# EAGLE schematic sboardnew (EAGLE 6.6.0)

## Sheet 1 of 5
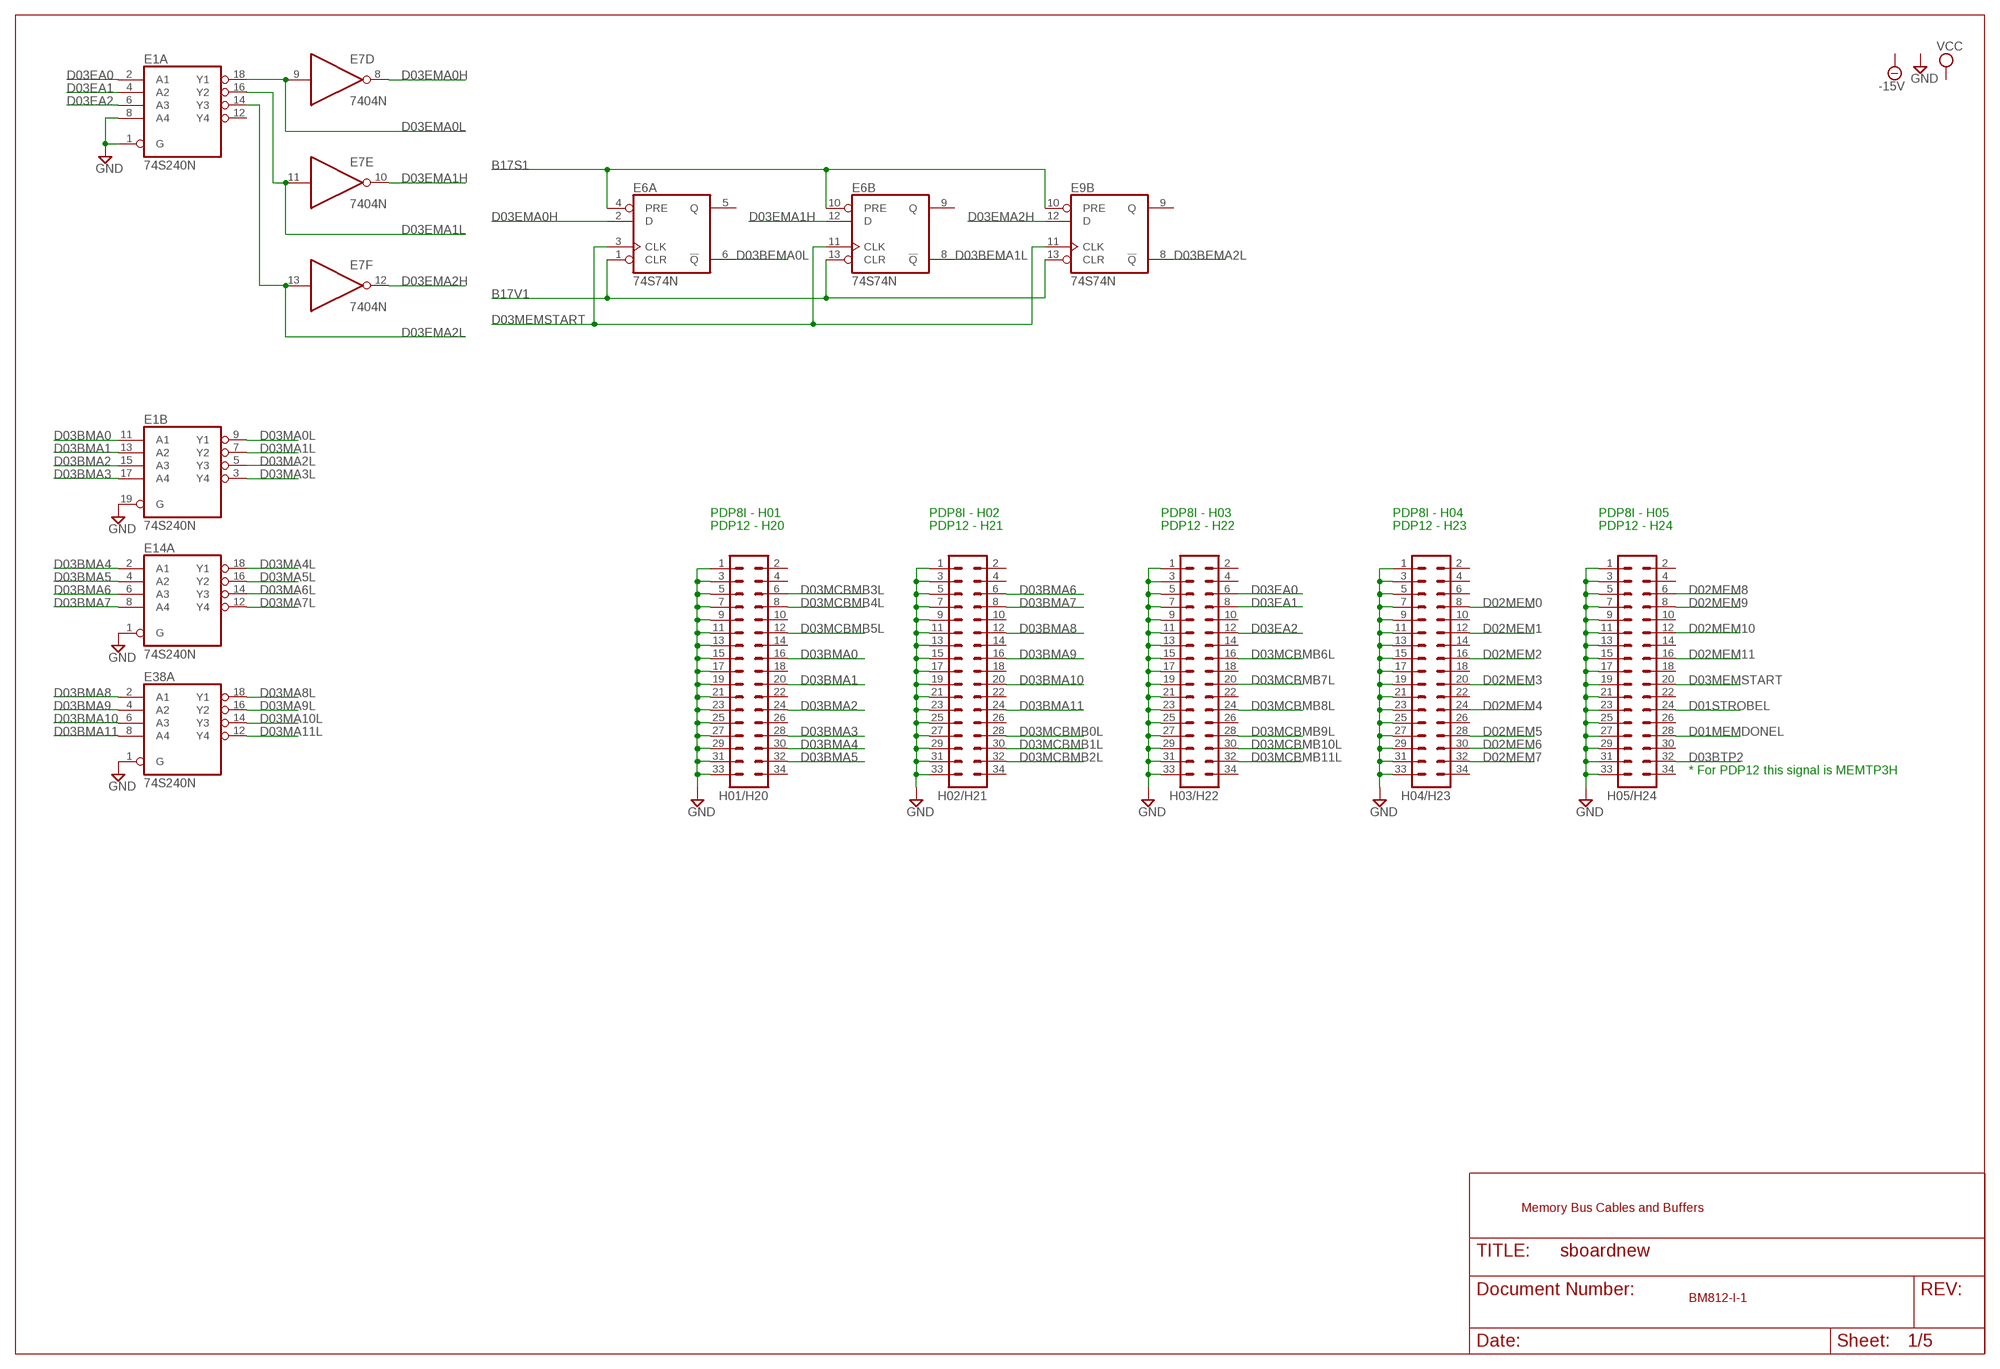
[diagram p0: schematic, sheet 1]

### Parts
E1  74S240N  [DIL20]
E6  74S74N  [DIL14]
E7  7404N  [DIL14]
E9  74S74N  [DIL14]
E14  74S240N  [DIL20]
E38  74S240N  [DIL20]
H01/H20  MA17-2  [MA17-2]
H02/H21  MA17-2  [MA17-2]
H03/H22  MA17-2  [MA17-2]
H04/H23  MA17-2  [MA17-2]
H05/H24  MA17-2  [MA17-2]

### Nets
B17S1: E6.4(A:PRE) E6.10(B:PRE) E9.10(B:PRE) ; also sheet 3,4
B17V1: E6.1(A:CLR) E6.13(B:CLR) E9.13(B:CLR) ; also sheet 3,4
D01MEMDONEL: H05/H24.28 ; also sheet 4
D01STROBEL: H05/H24.24 ; also sheet 4
D02MEM0: H04/H23.8 ; also sheet 3
D02MEM1: H04/H23.12 ; also sheet 3
D02MEM2: H04/H23.16 ; also sheet 3
D02MEM3: H04/H23.20 ; also sheet 3
D02MEM4: H04/H23.24 ; also sheet 3
D02MEM5: H04/H23.28 ; also sheet 3
D02MEM6: H04/H23.30 ; also sheet 3
D02MEM7: H04/H23.32 ; also sheet 3
D02MEM8: H05/H24.6 ; also sheet 3
D02MEM9: H05/H24.8 ; also sheet 3
D02MEM10: H05/H24.12 ; also sheet 3
D02MEM11: H05/H24.16 ; also sheet 3
D03BEMA0L: E6.6(A:!Q) ; also sheet 5
D03BEMA1L: E6.8(B:!Q) ; also sheet 5
D03BEMA2L: E9.8(B:!Q) ; also sheet 5
D03BMA0: E1.11(B:A1) H01/H20.16
D03BMA1: E1.13(B:A2) H01/H20.20
D03BMA2: E1.15(B:A3) H01/H20.24
D03BMA3: E1.17(B:A4) H01/H20.28
D03BMA4: E14.2(A:A1) H01/H20.30
D03BMA5: E14.4(A:A2) H01/H20.32
D03BMA6: E14.6(A:A3) H02/H21.6
D03BMA7: E14.8(A:A4) H02/H21.8
D03BMA8: E38.2(A:A1) H02/H21.12
D03BMA9: E38.4(A:A2) H02/H21.16
D03BMA10: E38.6(A:A3) H02/H21.20
D03BMA11: E38.8(A:A4) H02/H21.24
D03BTP2: H05/H24.32 ; also sheet 4
D03EA0: E1.2(A:A1) H03/H22.6
D03EA1: E1.4(A:A2) H03/H22.8
D03EA2: E1.6(A:A3) H03/H22.12
D03EMA0H: E6.2(A:D) E7.8(D:O) ; also sheet 4
D03EMA0L: E1.18(A:Y1) E7.9(D:I) ; also sheet 4
D03EMA1H: E6.12(B:D) E7.10(E:O) ; also sheet 4
D03EMA1L: E1.16(A:Y2) E7.11(E:I) ; also sheet 4
D03EMA2H: E7.12(F:O) E9.12(B:D) ; also sheet 4
D03EMA2L: E1.14(A:Y3) E7.13(F:I) ; also sheet 4
D03MA0L: E1.9(B:Y1) ; also sheet 5
D03MA1L: E1.7(B:Y2) ; also sheet 5
D03MA2L: E1.5(B:Y3) ; also sheet 5
D03MA3L: E1.3(B:Y4) ; also sheet 5
D03MA4L: E14.18(A:Y1) ; also sheet 5
D03MA5L: E14.16(A:Y2) ; also sheet 5
D03MA6L: E14.14(A:Y3) ; also sheet 5
D03MA7L: E14.12(A:Y4) ; also sheet 5
D03MA8L: E38.18(A:Y1) ; also sheet 5
D03MA9L: E38.16(A:Y2) ; also sheet 5
D03MA10L: E38.14(A:Y3) ; also sheet 5
D03MA11L: E38.12(A:Y4) ; also sheet 5
D03MCBMB0L: H02/H21.28 ; also sheet 2
D03MCBMB1L: H02/H21.30 ; also sheet 2
D03MCBMB2L: H02/H21.32 ; also sheet 2
D03MCBMB3L: H01/H20.6 ; also sheet 2
D03MCBMB4L: H01/H20.8 ; also sheet 2
D03MCBMB5L: H01/H20.12 ; also sheet 2
D03MCBMB6L: H03/H22.16 ; also sheet 2
D03MCBMB7L: H03/H22.20 ; also sheet 2
D03MCBMB8L: H03/H22.24 ; also sheet 2
D03MCBMB9L: H03/H22.28 ; also sheet 2
D03MCBMB10L: H03/H22.30 ; also sheet 2
D03MCBMB11L: H03/H22.32 ; also sheet 2
D03MEMSTART: E6.3(A:CLK) E6.11(B:CLK) E9.11(B:CLK) H05/H24.20 ; also sheet 4
GND [Power]: E1.1(A:G) E1.8(A:A4) E1.19(B:G) E14.1(A:G) E38.1(A:G) H01/H20.1 H01/H20.3 H01/H20.5 H01/H20.7 H01/H20.9 H01/H20.11 H01/H20.13 H01/H20.15 H01/H20.17 H01/H20.19 H01/H20.21 H01/H20.23 H01/H20.25 H01/H20.27 H01/H20.29 H01/H20.31 H01/H20.33 H02/H21.1 H02/H21.3 H02/H21.5 H02/H21.7 H02/H21.9 H02/H21.11 H02/H21.13 H02/H21.15 H02/H21.17 H02/H21.19 H02/H21.21 H02/H21.23 H02/H21.25 H02/H21.27 H02/H21.29 H02/H21.31 H02/H21.33 H03/H22.1 H03/H22.3 H03/H22.5 H03/H22.7 H03/H22.9 H03/H22.11 H03/H22.13 H03/H22.15 H03/H22.17 H03/H22.19 H03/H22.21 H03/H22.23 H03/H22.25 H03/H22.27 H03/H22.29 H03/H22.31 H03/H22.33 H04/H23.1 H04/H23.3 H04/H23.5 H04/H23.7 H04/H23.9 H04/H23.11 H04/H23.13 H04/H23.15 H04/H23.17 H04/H23.19 H04/H23.21 H04/H23.23 H04/H23.25 H04/H23.27 H04/H23.29 H04/H23.31 H04/H23.33 H05/H24.1 H05/H24.3 H05/H24.5 H05/H24.7 H05/H24.9 H05/H24.11 H05/H24.13 H05/H24.15 H05/H24.17 H05/H24.19 H05/H24.21 H05/H24.23 H05/H24.25 H05/H24.27 H05/H24.29 H05/H24.31 H05/H24.33 ; also sheet 3,4,5
Unconnected: E1.12(A:Y4) E6.5(A:Q) E6.9(B:Q) E9.9(B:Q) E38.3(B:Y4) E38.5(B:Y3) E38.7(B:Y2) E38.9(B:Y1) E38.11(B:A1) E38.13(B:A2) E38.15(B:A3) E38.17(B:A4) E38.19(B:G) H01/H20.2 H01/H20.4 H01/H20.10 H01/H20.14 H01/H20.18 H01/H20.22 H01/H20.26 H01/H20.34 H02/H21.2 H02/H21.4 H02/H21.10 H02/H21.14 H02/H21.18 H02/H21.22 H02/H21.26 H02/H21.34 H03/H22.2 H03/H22.4 H03/H22.10 H03/H22.14 H03/H22.18 H03/H22.22 H03/H22.26 H03/H22.34 H04/H23.2 H04/H23.4 H04/H23.6 H04/H23.10 H04/H23.14 H04/H23.18 H04/H23.22 H04/H23.26 H04/H23.34 H05/H24.2 H05/H24.4 H05/H24.10 H05/H24.14 H05/H24.18 H05/H24.22 H05/H24.26 H05/H24.30 H05/H24.34

### Notes on the sheet
- PDP8I - H01 | PDP8I - H02 | PDP8I - H03 | PDP8I - H04 | PDP8I - H05
- PDP12 - H20 | PDP12 - H21 | PDP12 - H22 | PDP12 - H23 | PDP12 - H24
- * For PDP12 this signal is MEMTP3H
- Memory Bus Cables and Buffers
- BM812-I-1

## Sheet 2 of 5
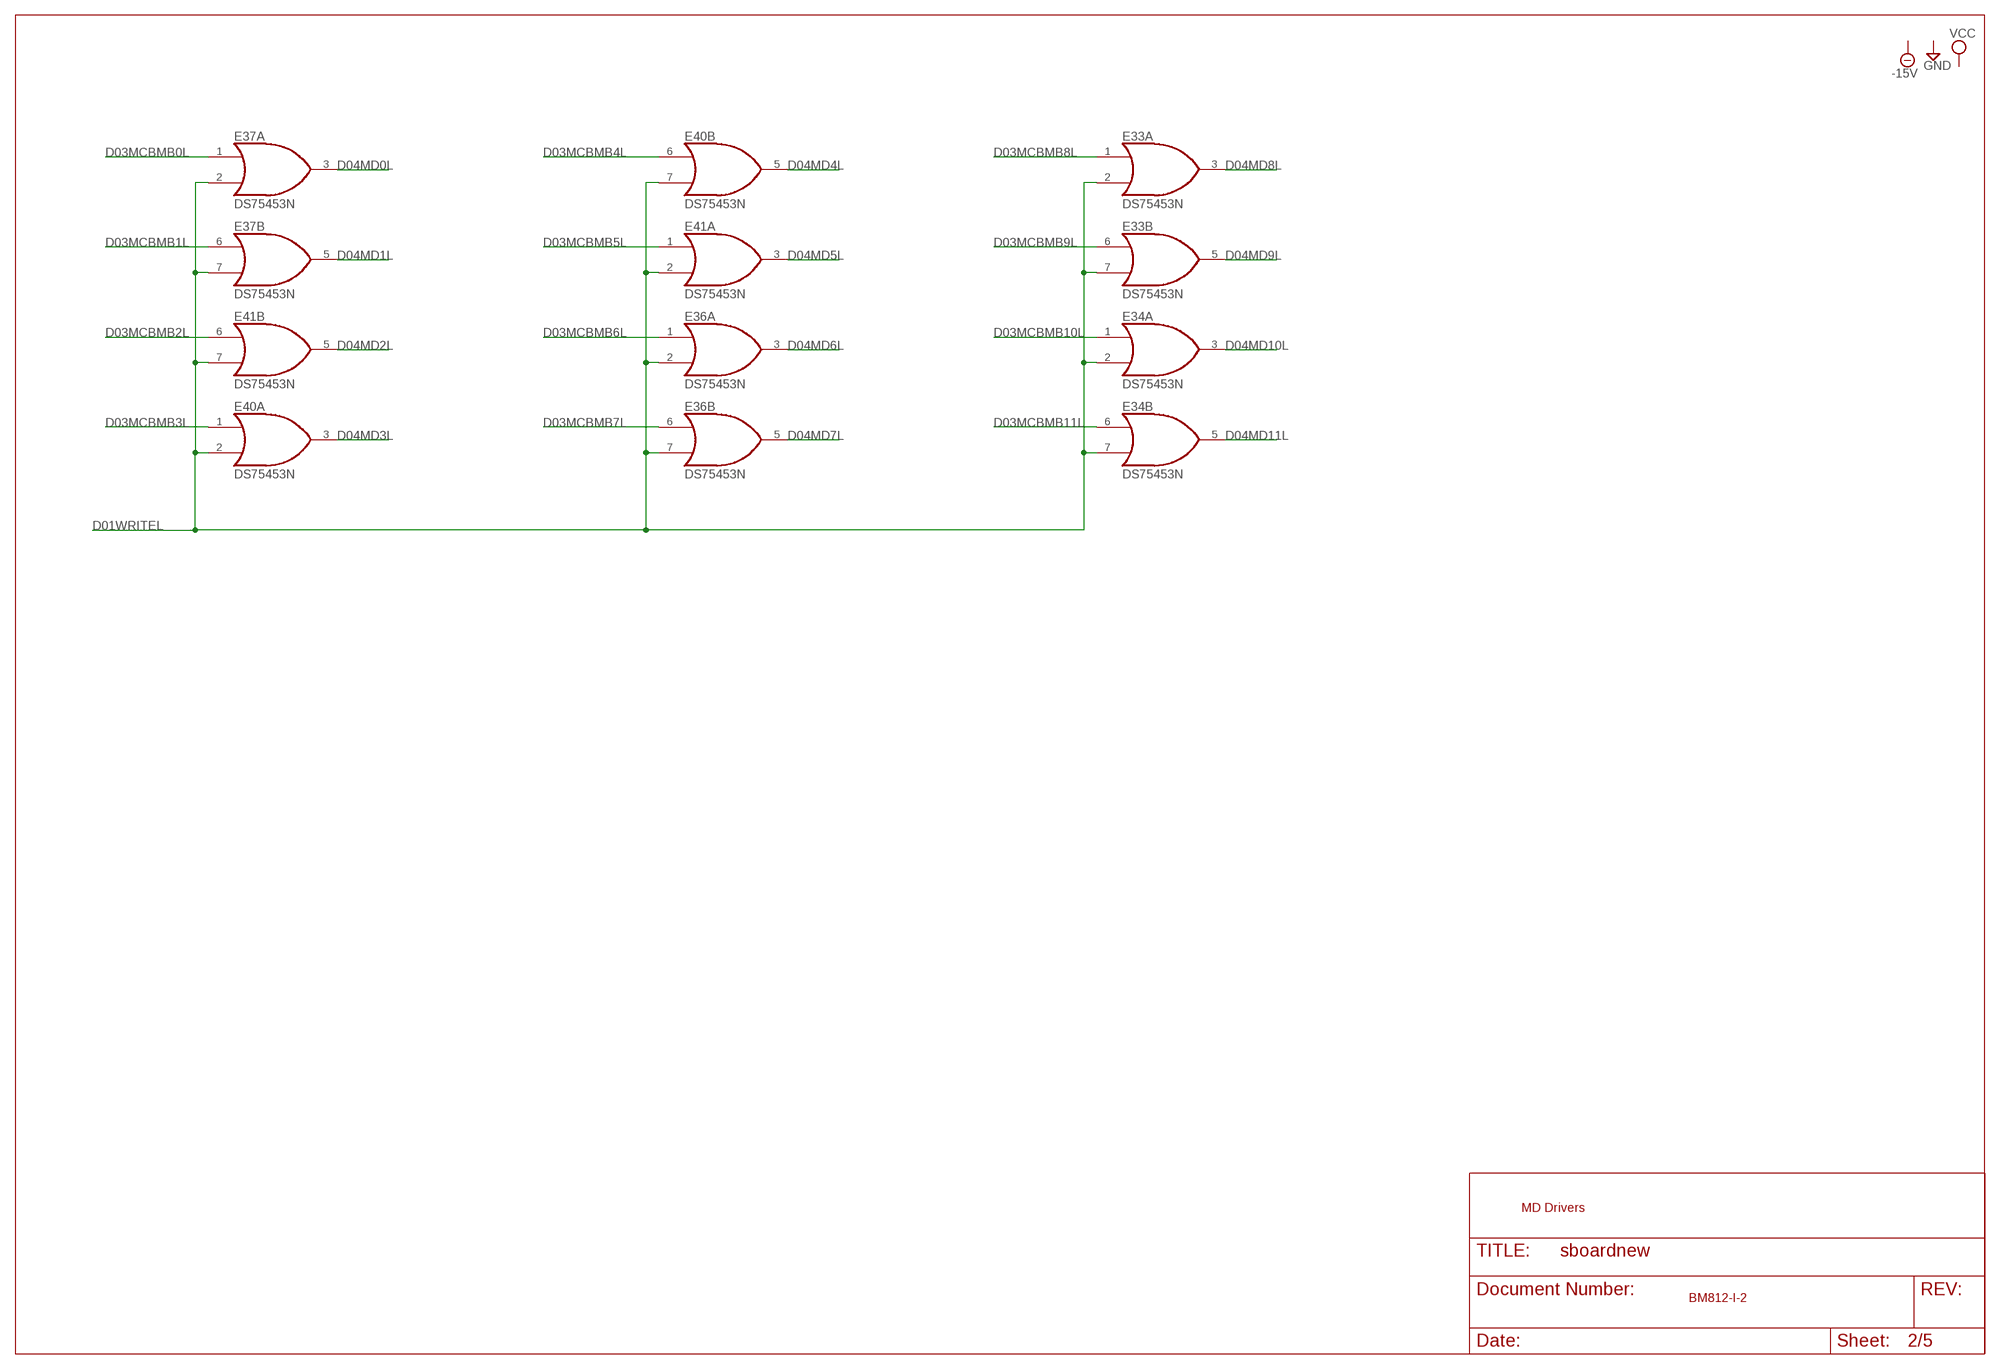
[diagram p1: schematic, sheet 2]

### Parts
E33  DS75453N  [DIL08]
E34  DS75453N  [DIL08]
E36  DS75453N  [DIL08]
E37  DS75453N  [DIL08]
E40  DS75453N  [DIL08]
E41  DS75453N  [DIL08]

### Nets
D01WRITEL: E33.2(A:I1) E33.7(B:I1) E34.2(A:I1) E34.7(B:I1) E36.2(A:I1) E36.7(B:I1) E37.2(A:I1) E37.7(B:I1) E40.2(A:I1) E40.7(B:I1) E41.2(A:I1) E41.7(B:I1) ; also sheet 3
D03MCBMB0L: E37.1(A:I0) ; also sheet 1
D03MCBMB1L: E37.6(B:I0) ; also sheet 1
D03MCBMB2L: E41.6(B:I0) ; also sheet 1
D03MCBMB3L: E40.1(A:I0) ; also sheet 1
D03MCBMB4L: E40.6(B:I0) ; also sheet 1
D03MCBMB5L: E41.1(A:I0) ; also sheet 1
D03MCBMB6L: E36.1(A:I0) ; also sheet 1
D03MCBMB7L: E36.6(B:I0) ; also sheet 1
D03MCBMB8L: E33.1(A:I0) ; also sheet 1
D03MCBMB9L: E33.6(B:I0) ; also sheet 1
D03MCBMB10L: E34.1(A:I0) ; also sheet 1
D03MCBMB11L: E34.6(B:I0) ; also sheet 1
D04MD0L: E37.3(A:O) ; also sheet 3,5
D04MD1L: E37.5(B:O) ; also sheet 3,5
D04MD2L: E41.5(B:O) ; also sheet 3,5
D04MD3L: E40.3(A:O) ; also sheet 3,5
D04MD4L: E40.5(B:O) ; also sheet 3,5
D04MD5L: E41.3(A:O) ; also sheet 3,5
D04MD6L: E36.3(A:O) ; also sheet 3,5
D04MD7L: E36.5(B:O) ; also sheet 3,5
D04MD8L: E33.3(A:O) ; also sheet 3,5
D04MD9L: E33.5(B:O) ; also sheet 3,5
D04MD10L: E34.3(A:O) ; also sheet 3,5
D04MD11L: E34.5(B:O) ; also sheet 3,5

### Notes on the sheet
- MD Drivers
- BM812-I-2

## Sheet 3 of 5
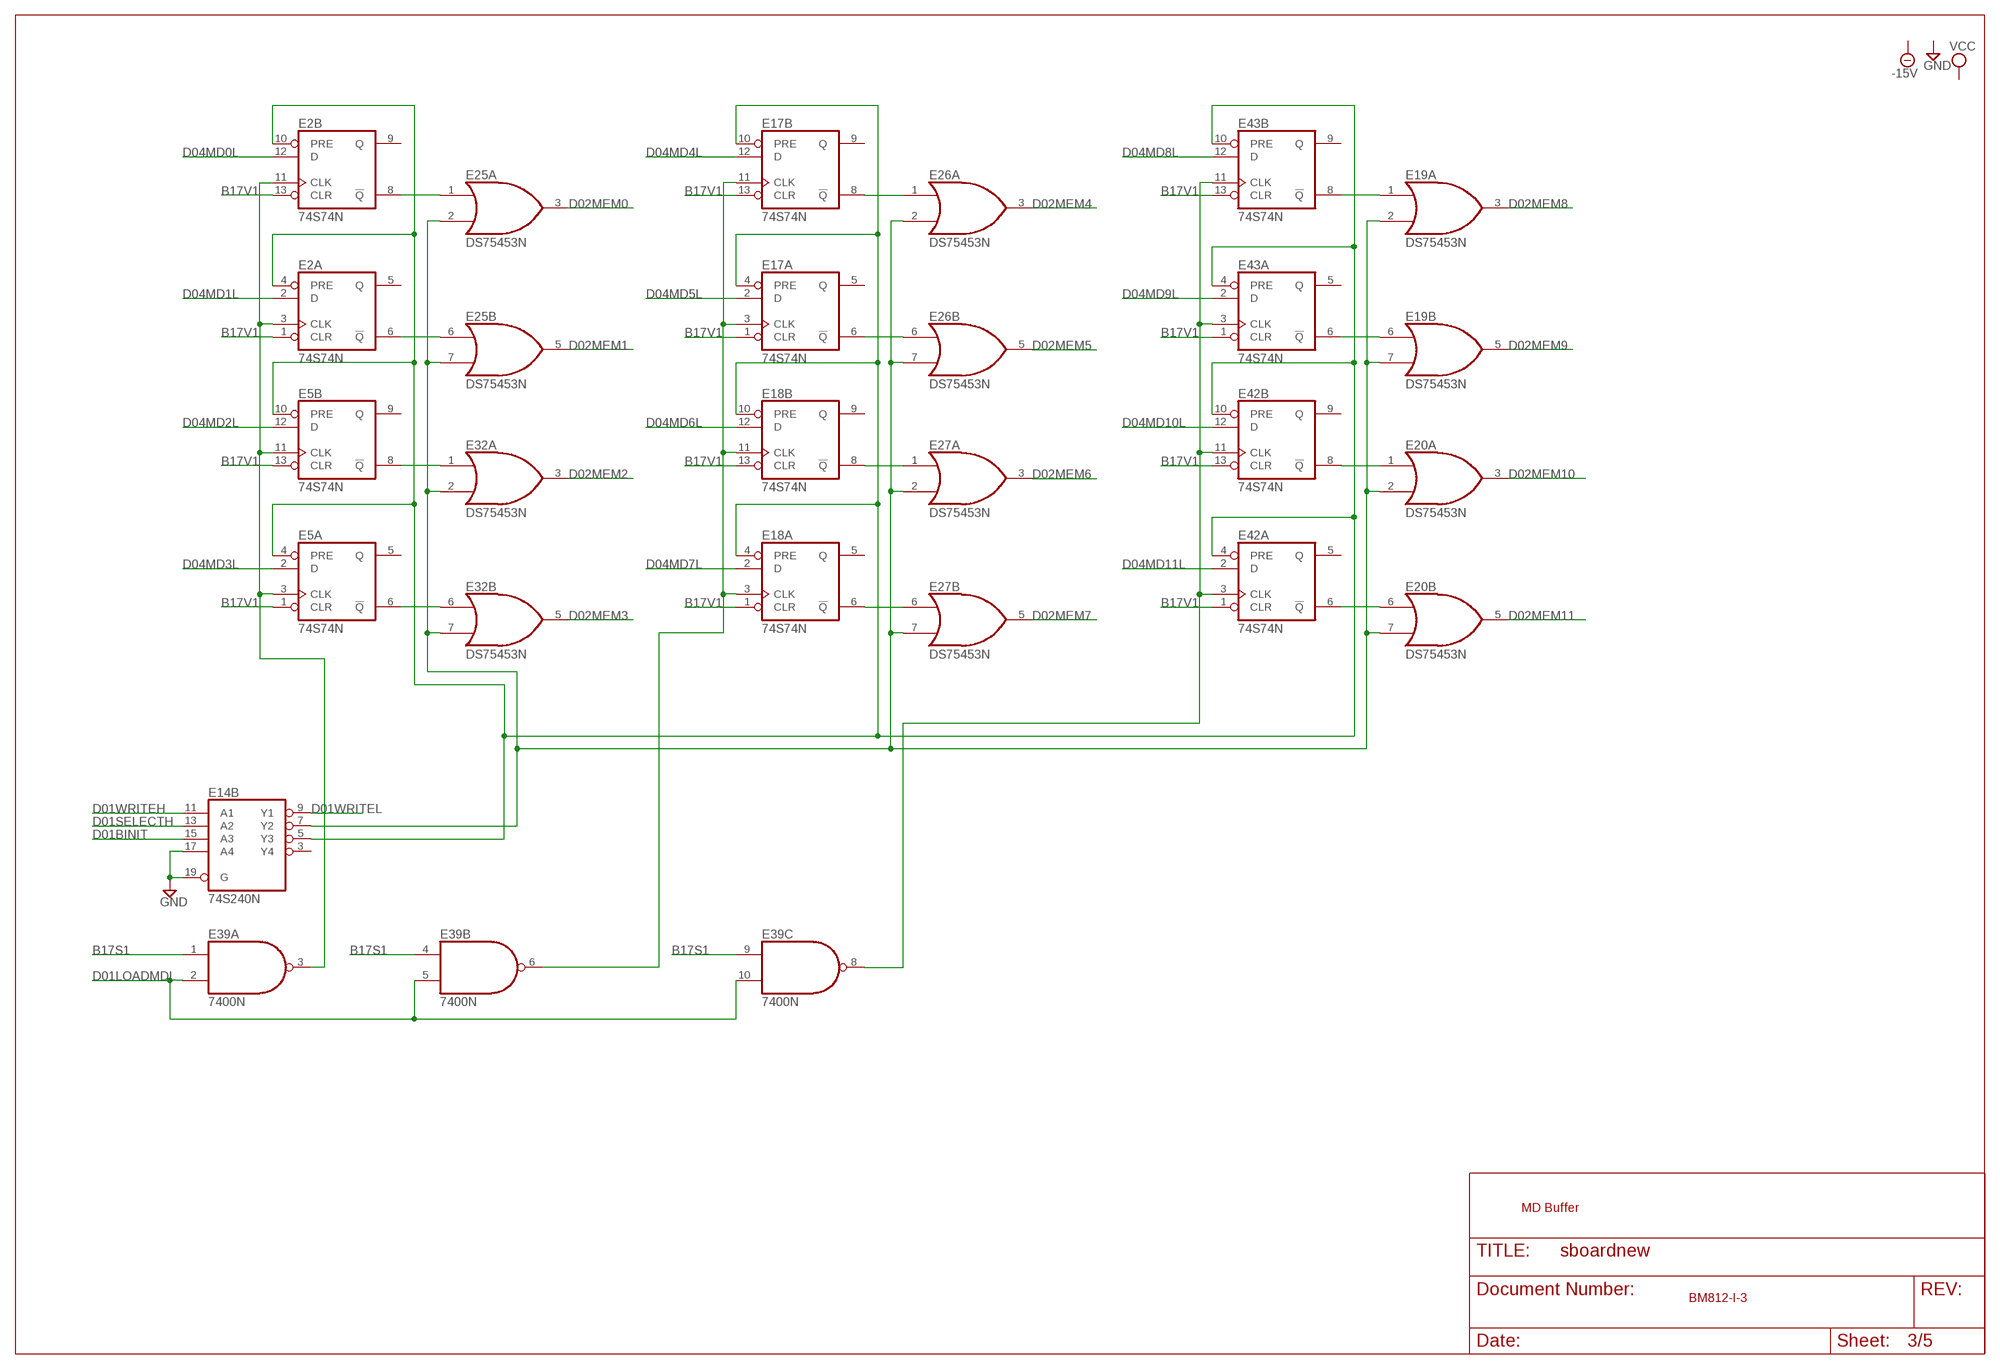
[diagram p2: schematic, sheet 3]

### Parts
E2  74S74N  [DIL14]
E5  74S74N  [DIL14]
E17  74S74N  [DIL14]
E18  74S74N  [DIL14]
E19  DS75453N  [DIL08]
E20  DS75453N  [DIL08]
E25  DS75453N  [DIL08]
E26  DS75453N  [DIL08]
E27  DS75453N  [DIL08]
E32  DS75453N  [DIL08]
E39  7400N  [DIL14]
E42  74S74N  [DIL14]
E43  74S74N  [DIL14]

### Nets
B17S1: E39.1(A:I0) E39.4(B:I0) E39.9(C:I0) ; also sheet 1,4
B17V1: E2.1(A:CLR) E2.13(B:CLR) E5.1(A:CLR) E5.13(B:CLR) E17.1(A:CLR) E17.13(B:CLR) E18.1(A:CLR) E18.13(B:CLR) E42.1(A:CLR) E42.13(B:CLR) E43.1(A:CLR) E43.13(B:CLR) ; also sheet 1,4
D01BINIT: E14.15(B:A3) ; also sheet 4
D01LOADMDL: E39.2(A:I1) E39.5(B:I1) E39.10(C:I1) ; also sheet 4
D01SELECTH: E14.13(B:A2) ; also sheet 4
D01WRITEH: E14.11(B:A1) ; also sheet 4
D01WRITEL: E14.9(B:Y1) ; also sheet 2
D02MEM0: E25.3(A:O) ; also sheet 1
D02MEM1: E25.5(B:O) ; also sheet 1
D02MEM2: E32.3(A:O) ; also sheet 1
D02MEM3: E32.5(B:O) ; also sheet 1
D02MEM4: E26.3(A:O) ; also sheet 1
D02MEM5: E26.5(B:O) ; also sheet 1
D02MEM6: E27.3(A:O) ; also sheet 1
D02MEM7: E27.5(B:O) ; also sheet 1
D02MEM8: E19.3(A:O) ; also sheet 1
D02MEM9: E19.5(B:O) ; also sheet 1
D02MEM10: E20.3(A:O) ; also sheet 1
D02MEM11: E20.5(B:O) ; also sheet 1
D04MD0L: E2.12(B:D) ; also sheet 2,5
D04MD1L: E2.2(A:D) ; also sheet 2,5
D04MD2L: E5.12(B:D) ; also sheet 2,5
D04MD3L: E5.2(A:D) ; also sheet 2,5
D04MD4L: E17.12(B:D) ; also sheet 2,5
D04MD5L: E17.2(A:D) ; also sheet 2,5
D04MD6L: E18.12(B:D) ; also sheet 2,5
D04MD7L: E18.2(A:D) ; also sheet 2,5
D04MD8L: E43.12(B:D) ; also sheet 2,5
D04MD9L: E43.2(A:D) ; also sheet 2,5
D04MD10L: E42.12(B:D) ; also sheet 2,5
D04MD11L: E42.2(A:D) ; also sheet 2,5
GND [Power]: E14.17(B:A4) E14.19(B:G) ; also sheet 1,4,5
N$8: E2.3(A:CLK) E2.11(B:CLK) E5.3(A:CLK) E5.11(B:CLK) E39.3(A:O)
N$12: E5.6(A:!Q) E32.6(B:I0)
N$14: E2.8(B:!Q) E25.1(A:I0)
N$15: E2.6(A:!Q) E25.6(B:I0)
N$16: E17.3(A:CLK) E17.11(B:CLK) E18.3(A:CLK) E18.11(B:CLK) E39.6(B:O)
N$17: E5.8(B:!Q) E32.1(A:I0)
N$21: E2.4(A:PRE) E2.10(B:PRE) E5.4(A:PRE) E5.10(B:PRE) E14.5(B:Y3) E17.4(A:PRE) E17.10(B:PRE) E18.4(A:PRE) E18.10(B:PRE) E42.4(A:PRE) E42.10(B:PRE) E43.4(A:PRE) E43.10(B:PRE)
N$22: E14.7(B:Y2) E19.2(A:I1) E19.7(B:I1) E20.2(A:I1) E20.7(B:I1) E25.2(A:I1) E25.7(B:I1) E26.2(A:I1) E26.7(B:I1) E27.2(A:I1) E27.7(B:I1) E32.2(A:I1) E32.7(B:I1)
N$24: E17.6(A:!Q) E26.6(B:I0)
N$25: E18.6(A:!Q) E27.6(B:I0)
N$26: E18.8(B:!Q) E27.1(A:I0)
N$27: E17.8(B:!Q) E26.1(A:I0)
N$29: E20.6(B:I0) E42.6(A:!Q)
N$30: E20.1(A:I0) E42.8(B:!Q)
N$41: E39.8(C:O) E42.3(A:CLK) E42.11(B:CLK) E43.3(A:CLK) E43.11(B:CLK)
N$67: E19.6(B:I0) E43.6(A:!Q)
N$68: E19.1(A:I0) E43.8(B:!Q)
Unconnected: E2.5(A:Q) E2.9(B:Q) E5.5(A:Q) E5.9(B:Q) E14.3(B:Y4) E17.5(A:Q) E17.9(B:Q) E18.5(A:Q) E18.9(B:Q) E42.5(A:Q) E42.9(B:Q) E43.5(A:Q) E43.9(B:Q)

### Notes on the sheet
- MD Buffer
- BM812-I-3

## Sheet 4 of 5
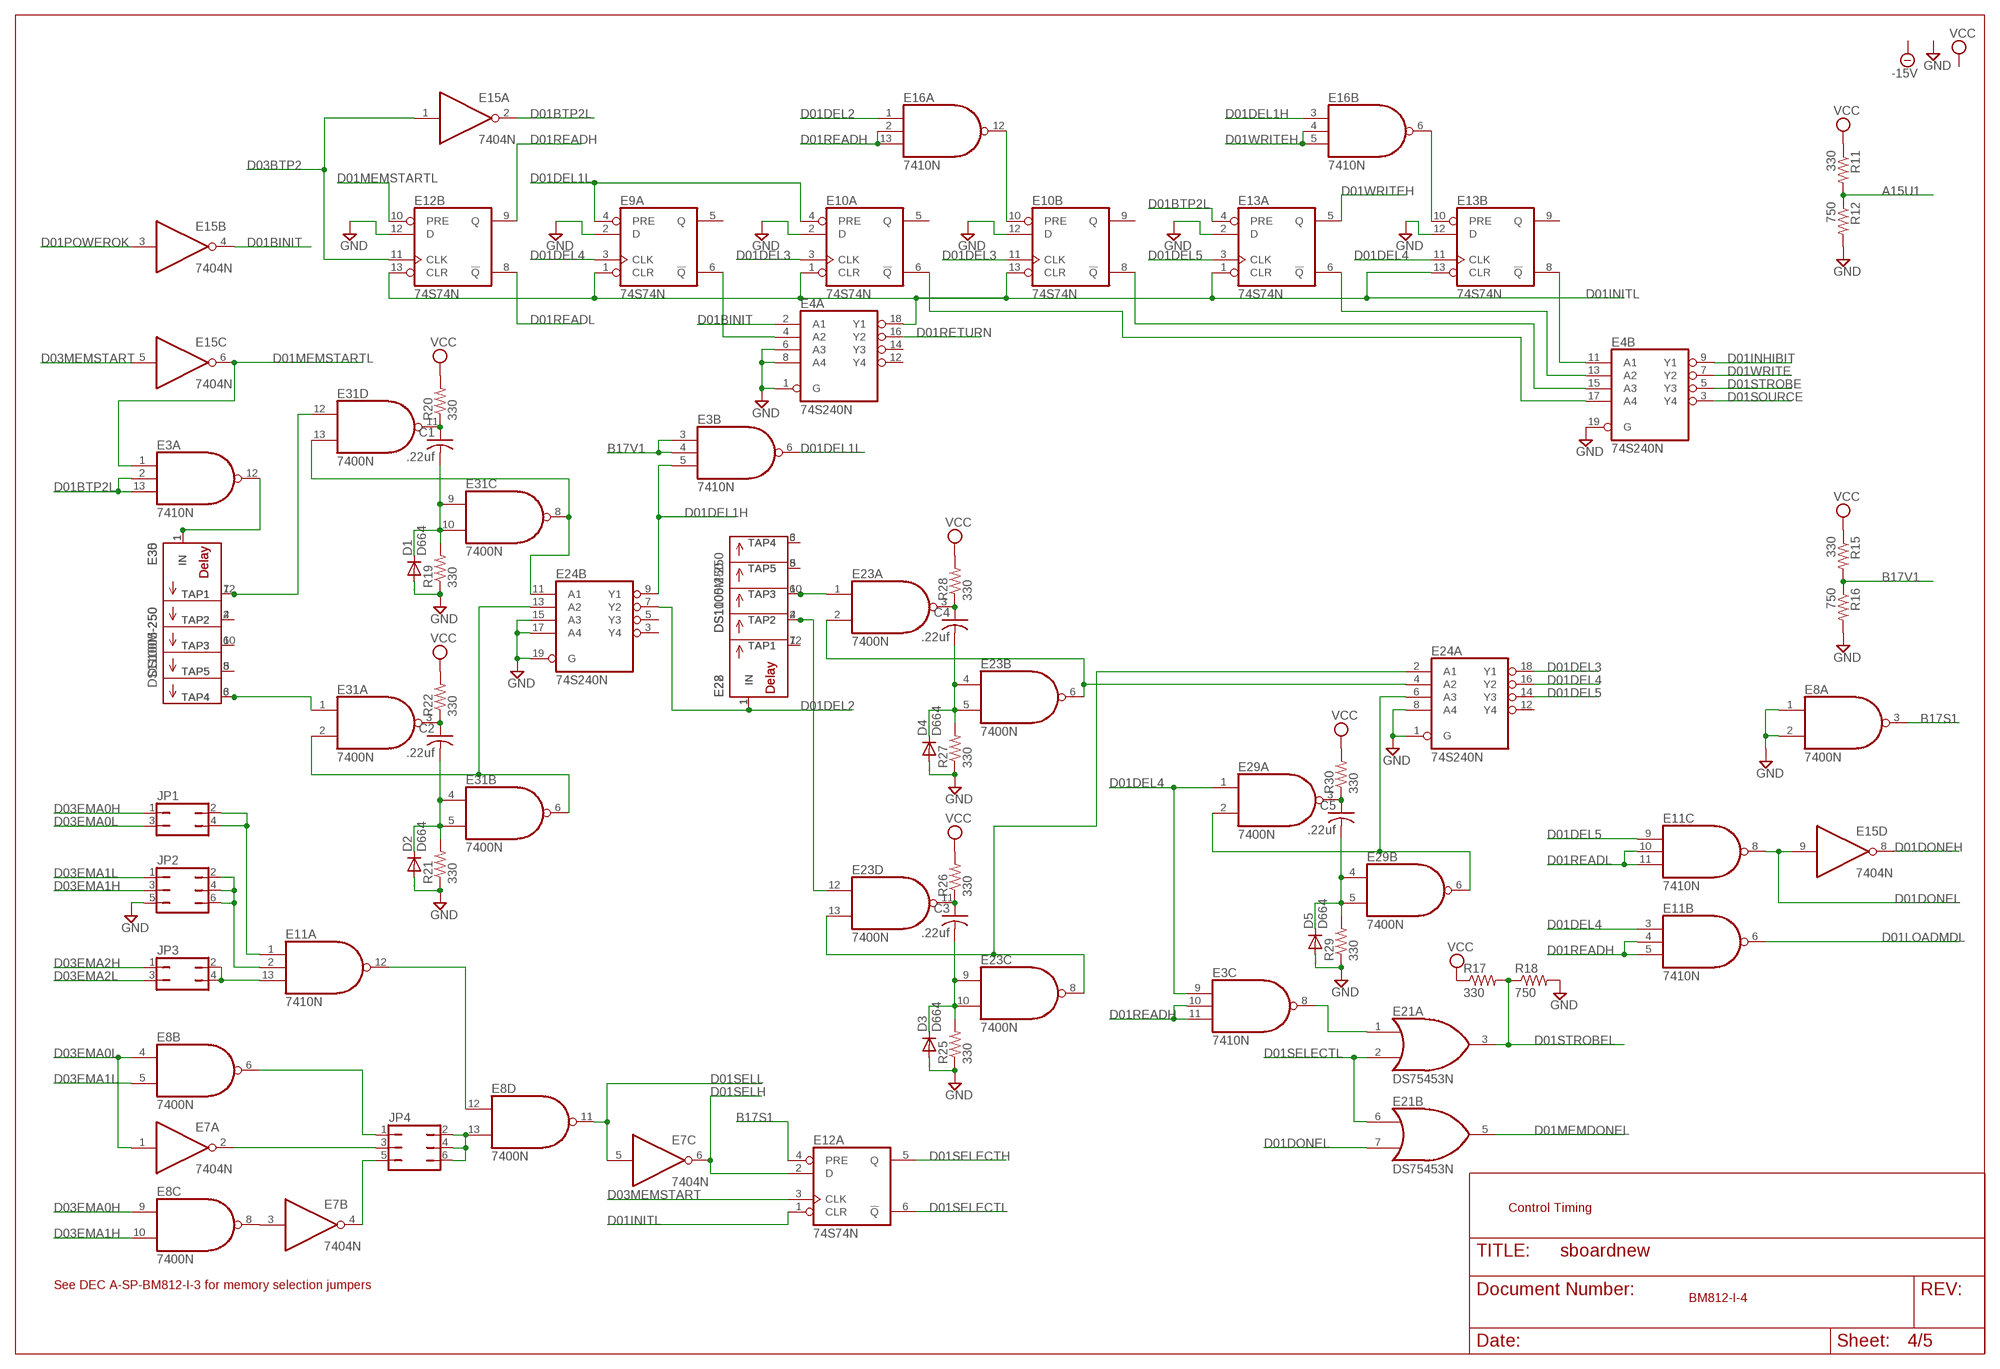
[diagram p3: schematic, sheet 4]

### Parts
C1  .22uf  C-US050-025X075  [C050-025X075]
C2  .22uf  C-US050-025X075  [C050-025X075]
C3  .22uf  C-US050-025X075  [C050-025X075]
C4  .22uf  C-US050-025X075  [C050-025X075]
C5  .22uf  C-US050-025X075  [C050-025X075]
D1  D664  1N4148DO35-10  [DO35-10]
D2  D664  1N4148DO35-10  [DO35-10]
D3  D664  1N4148DO35-10  [DO35-10]
D4  D664  1N4148DO35-10  [DO35-10]
D5  D664  1N4148DO35-10  [DO35-10]
E3  7410N  [DIL14]
E4  74S240N  [DIL20]
E8  7400N  [DIL14]
E10  74S74N  [DIL14]
E11  7410N  [DIL14]
E12  74S74N  [DIL14]
E13  74S74N  [DIL14]
E15  7404N  [DIL14]
E16  7410N  [DIL14]
E21  DS75453N  [DIL08]
E22  DS1100M-250  MXD1000  [DIL08]
E23  7400N  [DIL14]
E24  74S240N  [DIL20]
E28  DS1005-250  MXD1000P  [DIL14]
E29  7400N  [DIL14]
E30  DS1005-250  MXD1000P  [DIL14]
E31  7400N  [DIL14]
E35  DS1100M-250  MXD1000  [DIL08]
JP1  JP2Q  [JP2Q]
JP2  JP3Q  [JP3Q]
JP3  JP2Q  [JP2Q]
JP4  JP3Q  [JP3Q]
R11  330  R-US_0207/10  [0207/10]
R12  750  R-US_0207/10  [0207/10]
R15  330  R-US_0207/10  [0207/10]
R16  750  R-US_0207/10  [0207/10]
R17  330  R-US_0207/10  [0207/10]
R18  750  R-US_0207/10  [0207/10]
R19  330  R-US_0207/10  [0207/10]
R20  330  R-US_0207/10  [0207/10]
R21  330  R-US_0207/10  [0207/10]
R22  330  R-US_0207/10  [0207/10]
R25  330  R-US_0207/10  [0207/10]
R26  330  R-US_0207/10  [0207/10]
R27  330  R-US_0207/10  [0207/10]
R28  330  R-US_0207/10  [0207/10]
R29  330  R-US_0207/10  [0207/10]
R30  330  R-US_0207/10  [0207/10]

### Nets
A15U1: R11.2 R12.1 ; also sheet 5
B17S1: E8.3(A:O) E12.4(A:PRE) ; also sheet 1,3
B17V1: E3.3(B:I0) E3.4(B:I1) R15.2 R16.1 ; also sheet 1,3
D01BINIT: E4.2(A:A1) E15.4(B:O) ; also sheet 3
D01BTP2L: E3.2(A:I1) E3.13(A:I2) E13.4(A:PRE) E15.2(A:O)
D01DEL1H: E3.5(B:I2) E16.3(B:I0) E24.9(B:Y1)
D01DEL1L: E3.6(B:O) E9.4(A:PRE) E10.4(A:PRE)
D01DEL2: E16.1(A:I0) E22.1(IN) E24.7(B:Y2) E28.1(IN)
D01DEL3: E10.3(A:CLK) E10.11(B:CLK) E24.18(A:Y1)
D01DEL4: E3.9(C:I0) E9.3(A:CLK) E11.3(B:I0) E13.11(B:CLK) E24.16(A:Y2) E29.1(A:I0)
D01DEL5: E11.9(C:I0) E13.3(A:CLK) E24.14(A:Y3)
D01DONEH: E15.8(D:O) ; also sheet 5
D01DONEL: E11.8(C:O) E15.9(D:I) E21.7(B:I1)
D01INHIBIT: E4.9(B:Y1) ; also sheet 5
D01INITL: E4.18(A:Y1) E9.1(A:CLR) E10.1(A:CLR) E10.13(B:CLR) E12.1(A:CLR) E12.13(B:CLR) E13.1(A:CLR) E13.13(B:CLR)
D01LOADMDL: E11.6(B:O) ; also sheet 3
D01MEMDONEL: E21.5(B:O) ; also sheet 1
D01MEMSTARTL: E3.1(A:I0) E12.10(B:PRE) E15.6(C:O)
D01POWEROK: E15.3(B:I) ; also sheet 5
D01READH: E3.10(C:I1) E3.11(C:I2) E11.4(B:I1) E11.5(B:I2) E12.9(B:Q) E16.2(A:I1) E16.13(A:I2)
D01READL: E11.10(C:I1) E11.11(C:I2) E12.8(B:!Q) ; also sheet 5
D01RETURN: E4.16(A:Y2) ; also sheet 5
D01SELECTH: E12.5(A:Q) ; also sheet 3
D01SELECTL: E12.6(A:!Q) E21.2(A:I1) E21.6(B:I0)
D01SELH: E7.6(C:O) E12.2(A:D)
D01SELL: E7.5(C:I) E8.11(D:O)
D01SOURCE: E4.3(B:Y4) ; also sheet 5
D01STROBE: E4.5(B:Y3) ; also sheet 5
D01STROBEL: E21.3(A:O) R17.2 R18.1 ; also sheet 1
D01WRITE: E4.7(B:Y2) ; also sheet 5
D01WRITEH: E13.5(A:Q) E16.4(B:I1) E16.5(B:I2) ; also sheet 3
D03BTP2: E12.11(B:CLK) E15.1(A:I) ; also sheet 1
D03EMA0H: E8.9(C:I0) JP1.1 ; also sheet 1
D03EMA0L: E7.1(A:I) E8.4(B:I0) JP1.3 ; also sheet 1
D03EMA1H: E8.10(C:I1) JP2.3 ; also sheet 1
D03EMA1L: E8.5(B:I1) JP2.1 ; also sheet 1
D03EMA2H: JP3.1 ; also sheet 1
D03EMA2L: JP3.3 ; also sheet 1
D03MEMSTART: E12.3(A:CLK) E15.5(C:I) ; also sheet 1
GND [Power]: D1.A D2.A D3.A D4.A D5.A E4.1(A:G) E4.6(A:A3) E4.8(A:A4) E4.19(B:G) E8.1(A:I0) E8.2(A:I1) E9.2(A:D) E10.2(A:D) E10.12(B:D) E12.12(B:D) E13.2(A:D) E13.12(B:D) E24.1(A:G) E24.8(A:A4) E24.15(B:A3) E24.17(B:A4) E24.19(B:G) JP2.5 R12.2 R16.2 R18.2 R19.1 R21.1 R25.1 R27.1 R29.1 ; also sheet 1,3,5
N$3: C3.2 D3.C E23.9(C:I0) E23.10(C:I1) R25.2
N$5: C5.2 D5.C E29.4(B:I0) E29.5(B:I1) R29.2
N$7: E8.13(D:I1) JP4.2 JP4.4 JP4.6
N$9: C2.2 D2.C E31.4(B:I0) E31.5(B:I1) R21.2
N$10: E30.12(TAP1) E31.12(D:I0) E35.7(TAP1)
N$11: E22.2(TAP2) E23.12(D:I0) E28.4(TAP2)
N$13: C1.2 D1.C E31.9(C:I0) E31.10(C:I1) R19.2
N$18: E24.11(B:A1) E31.8(C:O) E31.13(D:I1)
N$19: C1.1 E31.11(D:O) R20.1
N$20: C2.1 E31.3(A:O) R22.1
N$23: E24.13(B:A2) E31.2(A:I1) E31.6(B:O)
N$28: C3.1 E23.11(D:O) R26.1
N$31: E30.6(TAP4) E31.1(A:I0) E35.3(TAP4)
N$32: E23.8(C:O) E23.13(D:I1) E24.2(A:A1)
N$33: C4.2 D4.C E23.4(B:I0) E23.5(B:I1) R27.2
N$34: C4.1 E23.3(A:O) R28.1
N$35: E3.12(A:O) E30.1(IN) E35.1(IN)
N$37: E23.2(A:I1) E23.6(B:O) E24.4(A:A2)
N$38: E22.6(TAP3) E23.1(A:I0) E28.10(TAP3)
N$39: C5.1 E29.3(A:O) R30.1
N$40: E24.6(A:A3) E29.2(A:I1) E29.6(B:O)
N$46: E10.10(B:PRE) E16.12(A:O)
N$48: E22.7(TAP1) E28.12(TAP1)
N$49: E22.3(TAP4) E28.6(TAP4)
N$50: E22.5(TAP5) E28.8(TAP5)
N$51: E30.4(TAP2) E35.2(TAP2)
N$52: E30.10(TAP3) E35.6(TAP3)
N$53: E30.8(TAP5) E35.5(TAP5)
N$73: E8.6(B:O) JP4.1
N$92: E13.10(B:PRE) E16.6(B:O)
N$94: E3.8(C:O) E21.1(A:I0)
N$96: E4.4(A:A2) E9.6(A:!Q)
N$100: E4.17(B:A4) E10.6(A:!Q)
N$101: E4.15(B:A3) E10.8(B:!Q)
N$103: E7.2(A:O) JP4.3
N$104: E4.13(B:A2) E13.6(A:!Q)
N$108: E7.3(B:I) E8.8(C:O)
N$109: E4.11(B:A1) E13.8(B:!Q)
N$111: E7.4(B:O) JP4.5
N$113: E11.13(A:I2) JP3.2 JP3.4
N$128: E11.2(A:I1) JP2.2 JP2.4 JP2.6
N$129: E11.1(A:I0) JP1.2 JP1.4
N$132: E8.12(D:I0) E11.12(A:O)
VCC [Power]: R11.1 R15.1 R17.1 R20.2 R22.2 R26.2 R28.2 R30.2 ; also sheet 5
Unconnected: E4.12(A:Y4) E4.14(A:Y3) E9.5(A:Q) E10.5(A:Q) E10.9(B:Q) E13.9(B:Q) E24.3(B:Y4) E24.5(B:Y3) E24.12(A:Y4) E28.2(NC) E28.3(NC) E28.5(NC) E28.9(NC) E28.11(NC) E28.13(NC) E30.2(NC) E30.3(NC) E30.5(NC) E30.9(NC) E30.11(NC) E30.13(NC)

### Notes on the sheet
- Control Timing
- See DEC A-SP-BM812-I-3 for memory selection jumpers
- BM812-I-4

## Sheet 5 of 5
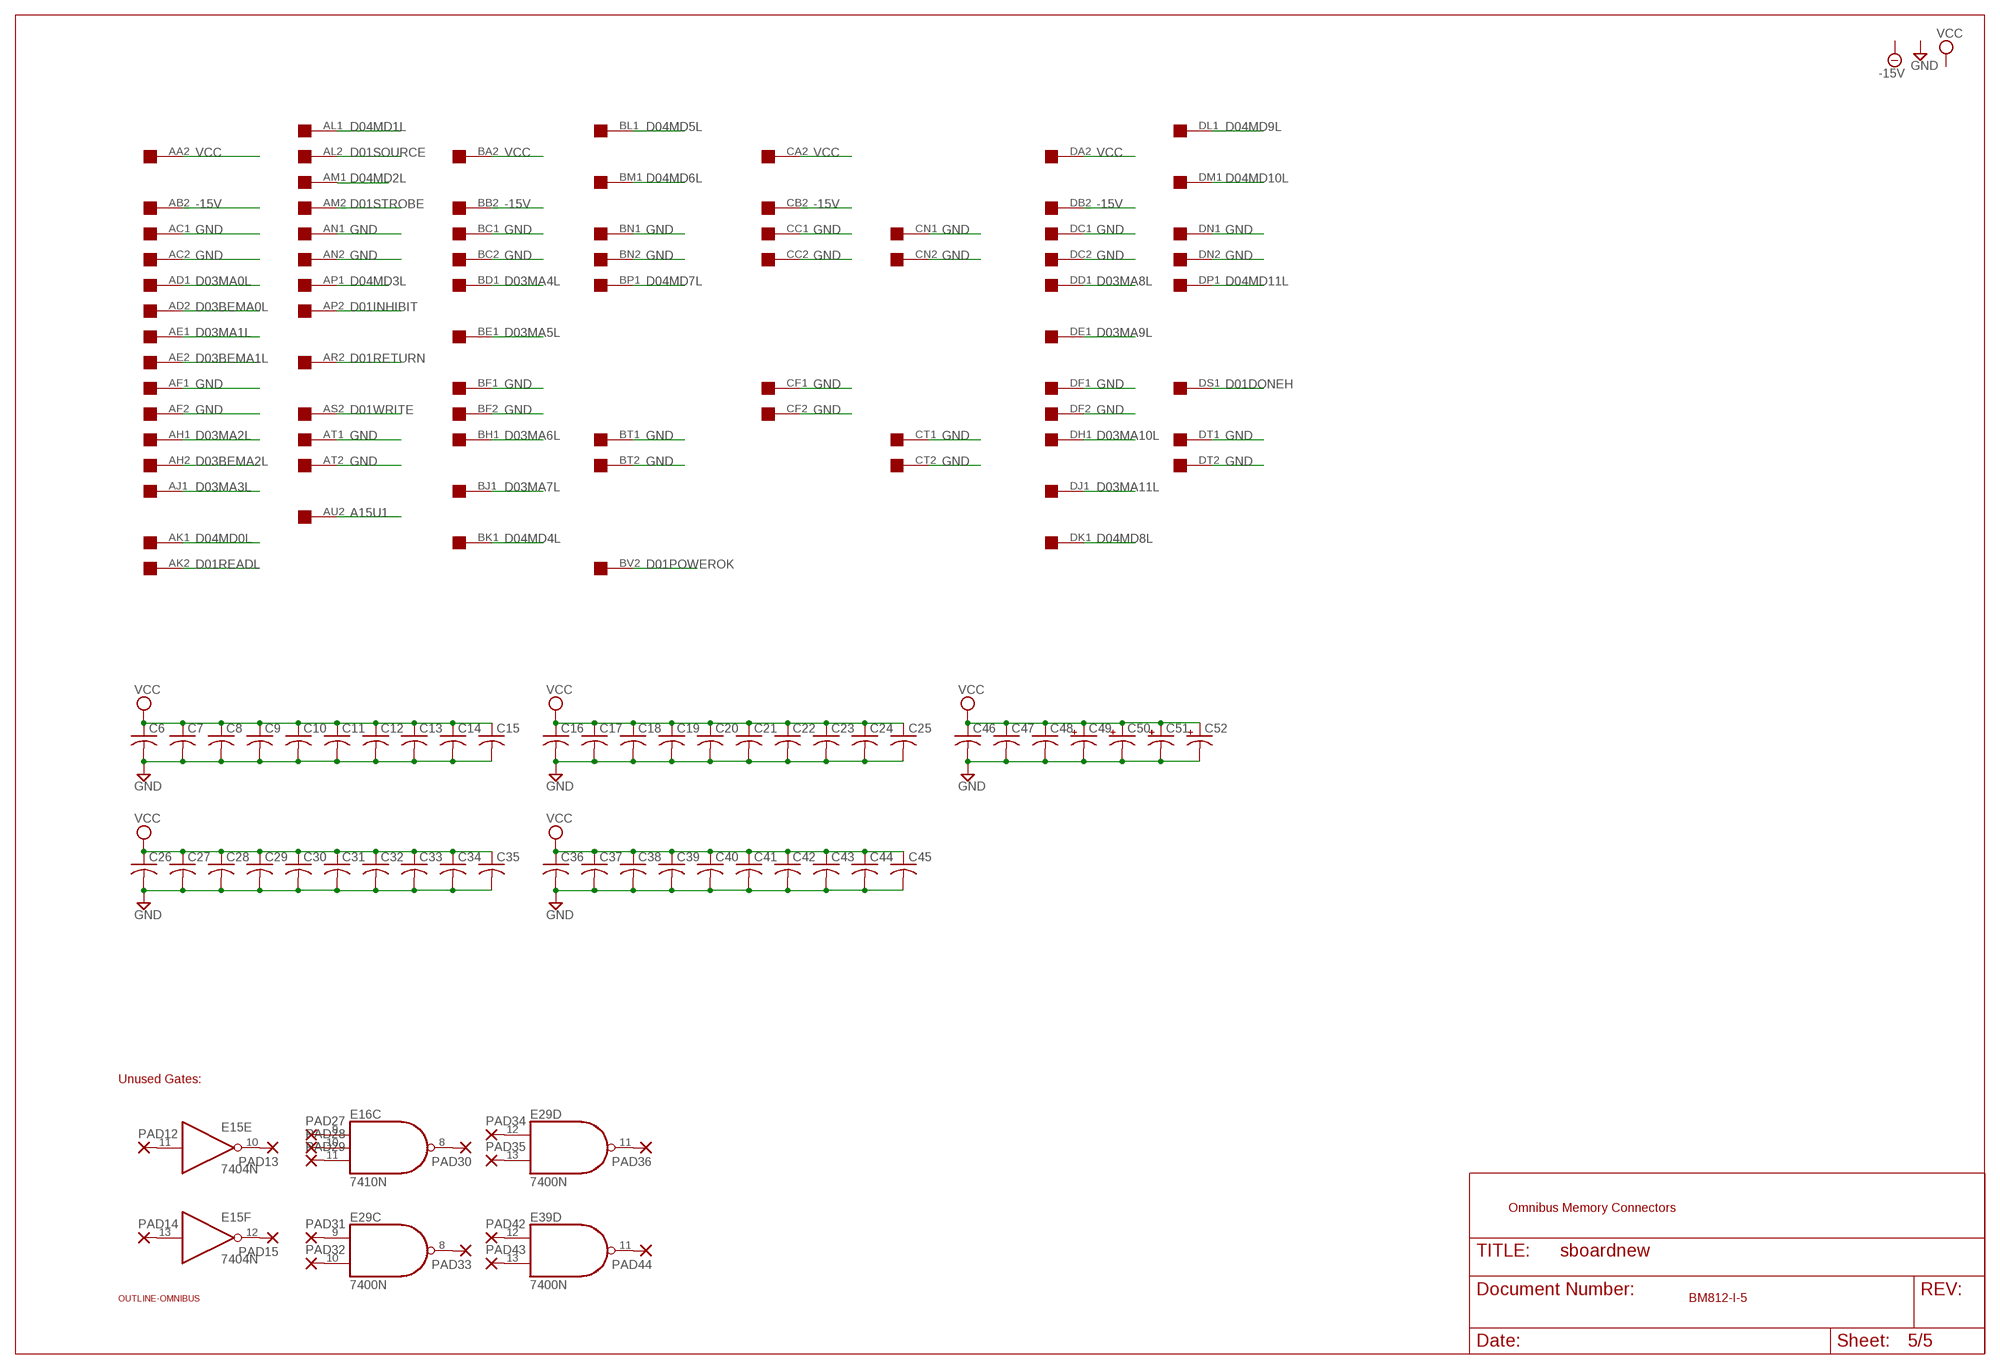
[diagram p4: schematic, sheet 5]

### Parts
C6  C-US050-025X075  [C050-025X075]
C7  C-US050-025X075  [C050-025X075]
C8  C-US050-025X075  [C050-025X075]
C9  C-US050-025X075  [C050-025X075]
C10  C-US050-025X075  [C050-025X075]
C11  C-US050-025X075  [C050-025X075]
C12  C-US050-025X075  [C050-025X075]
C13  C-US050-025X075  [C050-025X075]
C14  C-US050-025X075  [C050-025X075]
C15  C-US050-025X075  [C050-025X075]
C16  C-US050-025X075  [C050-025X075]
C17  C-US050-025X075  [C050-025X075]
C18  C-US050-025X075  [C050-025X075]
C19  C-US050-025X075  [C050-025X075]
C20  C-US050-025X075  [C050-025X075]
C21  C-US050-025X075  [C050-025X075]
C22  C-US050-025X075  [C050-025X075]
C23  C-US050-025X075  [C050-025X075]
C24  C-US050-025X075  [C050-025X075]
C25  C-US050-025X075  [C050-025X075]
C26  C-US050-025X075  [C050-025X075]
C27  C-US050-025X075  [C050-025X075]
C28  C-US050-025X075  [C050-025X075]
C29  C-US050-025X075  [C050-025X075]
C30  C-US050-025X075  [C050-025X075]
C31  C-US050-025X075  [C050-025X075]
C32  C-US050-025X075  [C050-025X075]
C33  C-US050-025X075  [C050-025X075]
C34  C-US050-025X075  [C050-025X075]
C35  C-US050-025X075  [C050-025X075]
C36  C-US050-025X075  [C050-025X075]
C37  C-US050-025X075  [C050-025X075]
C38  C-US050-025X075  [C050-025X075]
C39  C-US050-025X075  [C050-025X075]
C40  C-US050-025X075  [C050-025X075]
C41  C-US050-025X075  [C050-025X075]
C42  C-US050-025X075  [C050-025X075]
C43  C-US050-025X075  [C050-025X075]
C44  C-US050-025X075  [C050-025X075]
C45  C-US050-025X075  [C050-025X075]
C46  C-US050-025X075  [C050-025X075]
C47  C-US050-025X075  [C050-025X075]
C48  C-US050-025X075  [C050-025X075]
C49  CPOL-USE22-6AXIAL  [E22-6]
C50  CPOL-USE22-6AXIAL  [E22-6]
C51  CPOL-USE22-6AXIAL  [E22-6]
C52  CPOL-USE22-6AXIAL  [E22-6]
PAD12  1,6/0,8  [1,6/0,8]
PAD13  1,6/0,8  [1,6/0,8]
PAD14  1,6/0,8  [1,6/0,8]
PAD15  1,6/0,8  [1,6/0,8]
PAD27  1,6/0,8  [1,6/0,8]
PAD28  1,6/0,8  [1,6/0,8]
PAD29  1,6/0,8  [1,6/0,8]
PAD30  1,6/0,8  [1,6/0,8]
PAD31  1,6/0,8  [1,6/0,8]
PAD32  1,6/0,8  [1,6/0,8]
PAD33  1,6/0,8  [1,6/0,8]
PAD34  1,6/0,8  [1,6/0,8]
PAD35  1,6/0,8  [1,6/0,8]
PAD36  1,6/0,8  [1,6/0,8]
PAD42  1,6/0,8  [1,6/0,8]
PAD43  1,6/0,8  [1,6/0,8]
PAD44  1,6/0,8  [1,6/0,8]
U$1  QUAD  [EDGE-CON8]
U$2  OUTLINE-OMNIBUS  [OMNIBUS]

### Nets
-15V [Power]: U$1.AB2 U$1.BB2 U$1.CB2 U$1.DB2
A15U1: U$1.AU2 ; also sheet 4
D01DONEH: U$1.DS1 ; also sheet 4
D01INHIBIT: U$1.AP2 ; also sheet 4
D01POWEROK: U$1.BV2 ; also sheet 4
D01READL: U$1.AK2 ; also sheet 4
D01RETURN: U$1.AR2 ; also sheet 4
D01SOURCE: U$1.AL2 ; also sheet 4
D01STROBE: U$1.AM2 ; also sheet 4
D01WRITE: U$1.AS2 ; also sheet 4
D03BEMA0L: U$1.AD2 ; also sheet 1
D03BEMA1L: U$1.AE2 ; also sheet 1
D03BEMA2L: U$1.AH2 ; also sheet 1
D03MA0L: U$1.AD1 ; also sheet 1
D03MA1L: U$1.AE1 ; also sheet 1
D03MA2L: U$1.AH1 ; also sheet 1
D03MA3L: U$1.AJ1 ; also sheet 1
D03MA4L: U$1.BD1 ; also sheet 1
D03MA5L: U$1.BE1 ; also sheet 1
D03MA6L: U$1.BH1 ; also sheet 1
D03MA7L: U$1.BJ1 ; also sheet 1
D03MA8L: U$1.DD1 ; also sheet 1
D03MA9L: U$1.DE1 ; also sheet 1
D03MA10L: U$1.DH1 ; also sheet 1
D03MA11L: U$1.DJ1 ; also sheet 1
D04MD0L: U$1.AK1 ; also sheet 2,3
D04MD1L: U$1.AL1 ; also sheet 2,3
D04MD2L: U$1.AM1 ; also sheet 2,3
D04MD3L: U$1.AP1 ; also sheet 2,3
D04MD4L: U$1.BK1 ; also sheet 2,3
D04MD5L: U$1.BL1 ; also sheet 2,3
D04MD6L: U$1.BM1 ; also sheet 2,3
D04MD7L: U$1.BP1 ; also sheet 2,3
D04MD8L: U$1.DK1 ; also sheet 2,3
D04MD9L: U$1.DL1 ; also sheet 2,3
D04MD10L: U$1.DM1 ; also sheet 2,3
D04MD11L: U$1.DP1 ; also sheet 2,3
GND [Power]: C6.2 C7.2 C8.2 C9.2 C10.2 C11.2 C12.2 C13.2 C14.2 C15.2 C16.2 C17.2 C18.2 C19.2 C20.2 C21.2 C22.2 C23.2 C24.2 C25.2 C26.2 C27.2 C28.2 C29.2 C30.2 C31.2 C32.2 C33.2 C34.2 C35.2 C36.2 C37.2 C38.2 C39.2 C40.2 C41.2 C42.2 C43.2 C44.2 C45.2 C46.2 C47.2 C48.2 C49.- C50.- C51.- C52.- U$1.AC1 U$1.AC2 U$1.AF1 U$1.AF2 U$1.AN1 U$1.AN2 U$1.AT1 U$1.AT2 U$1.BC1 U$1.BC2 U$1.BF1 U$1.BF2 U$1.BN1 U$1.BN2 U$1.BT1 U$1.BT2 U$1.CC1 U$1.CC2 U$1.CF1 U$1.CF2 U$1.CN1 U$1.CN2 U$1.CT1 U$1.CT2 U$1.DC1 U$1.DC2 U$1.DF1 U$1.DF2 U$1.DN1 U$1.DN2 U$1.DT1 U$1.DT2 ; also sheet 1,3,4
N$54: E15.11(E:I) PAD12.1(P)
N$55: E15.10(E:O) PAD13.1(P)
N$56: E15.13(F:I) PAD14.1(P)
N$57: E15.12(F:O) PAD15.1(P)
N$71: E16.9(C:I0) PAD27.1(P)
N$72: E16.10(C:I1) PAD28.1(P)
N$74: E16.11(C:I2) PAD29.1(P)
N$75: E16.8(C:O) PAD30.1(P)
N$76: E29.9(C:I0) PAD31.1(P)
N$77: E29.10(C:I1) PAD32.1(P)
N$78: E29.8(C:O) PAD33.1(P)
N$79: E29.12(D:I0) PAD34.1(P)
N$80: E29.13(D:I1) PAD35.1(P)
N$81: E29.11(D:O) PAD36.1(P)
N$87: E39.12(D:I0) PAD42.1(P)
N$88: E39.13(D:I1) PAD43.1(P)
N$89: E39.11(D:O) PAD44.1(P)
VCC [Power]: C6.1 C7.1 C8.1 C9.1 C10.1 C11.1 C12.1 C13.1 C14.1 C15.1 C16.1 C17.1 C18.1 C19.1 C20.1 C21.1 C22.1 C23.1 C24.1 C25.1 C26.1 C27.1 C28.1 C29.1 C30.1 C31.1 C32.1 C33.1 C34.1 C35.1 C36.1 C37.1 C38.1 C39.1 C40.1 C41.1 C42.1 C43.1 C44.1 C45.1 C46.1 C47.1 C48.1 C49.+ C50.+ C51.+ C52.+ U$1.AA2 U$1.BA2 U$1.CA2 U$1.DA2 ; also sheet 4
Unconnected: U$1.AA1 U$1.AB1 U$1.AJ2 U$1.AR1 U$1.AS1 U$1.AU1 U$1.AV1 U$1.AV2 U$1.BA1 U$1.BB1 U$1.BD2 U$1.BE2 U$1.BH2 U$1.BJ2 U$1.BK2 U$1.BL2 U$1.BM2 U$1.BP2 U$1.BR1 U$1.BR2 U$1.BS1 U$1.BS2 U$1.BU1 U$1.BU2 U$1.BV1 U$1.CA1 U$1.CB1 U$1.CD1 U$1.CD2 U$1.CE1 U$1.CE2 U$1.CH1 U$1.CH2 U$1.CJ1 U$1.CJ2 U$1.CK1 U$1.CK2 U$1.CL1 U$1.CL2 U$1.CM1 U$1.CM2 U$1.CP1 U$1.CP2 U$1.CR1 U$1.CR2 U$1.CS1 U$1.CS2 U$1.CU1 U$1.CU2 U$1.CV1 U$1.CV2 U$1.DA1 U$1.DB1 U$1.DD2 U$1.DE2 U$1.DH2 U$1.DJ2 U$1.DK2 U$1.DL2 U$1.DM2 U$1.DP2 U$1.DR1 U$1.DR2 U$1.DS2 U$1.DU1 U$1.DU2 U$1.DV1 U$1.DV2

### Notes on the sheet
- Unused Gates:
- Omnibus Memory Connectors
- BM812-I-5

## Power pins joined to a net without a drawn wire
GND: E1.10(P:GND) E2.7(P:GND) E3.7(P:GND) E4.10(P:GND) E5.7(P:GND) E6.7(P:GND) E7.7(P:GND) E8.7(P:GND) E9.7(P:GND) E10.7(P:GND) E11.7(P:GND) E12.7(P:GND) E13.7(P:GND) E14.10(P:GND) E15.7(P:GND) E16.7(P:GND) E17.7(P:GND) E18.7(P:GND) E19.4(P:GND) E20.4(P:GND) E21.4(P:GND) E22.4(GND) E23.7(P:GND) E24.10(P:GND) E25.4(P:GND) E26.4(P:GND) E27.4(P:GND) E28.7(GND) E29.7(P:GND) E30.7(GND) E31.7(P:GND) E32.4(P:GND) E33.4(P:GND) E34.4(P:GND) E35.4(GND) E36.4(P:GND) E37.4(P:GND) E38.10(P:GND) E39.7(P:GND) E40.4(P:GND) E41.4(P:GND) E42.7(P:GND) E43.7(P:GND)
VCC: E1.20(P:VCC) E2.14(P:VCC) E3.14(P:VCC) E4.20(P:VCC) E5.14(P:VCC) E6.14(P:VCC) E7.14(P:VCC) E8.14(P:VCC) E9.14(P:VCC) E10.14(P:VCC) E11.14(P:VCC) E12.14(P:VCC) E13.14(P:VCC) E14.20(P:VCC) E15.14(P:VCC) E16.14(P:VCC) E17.14(P:VCC) E18.14(P:VCC) E19.8(P:VCC) E20.8(P:VCC) E21.8(P:VCC) E22.8(VCC) E23.14(P:VCC) E24.20(P:VCC) E25.8(P:VCC) E26.8(P:VCC) E27.8(P:VCC) E28.14(VCC) E29.14(P:VCC) E30.14(VCC) E31.14(P:VCC) E32.8(P:VCC) E33.8(P:VCC) E34.8(P:VCC) E35.8(VCC) E36.8(P:VCC) E37.8(P:VCC) E38.20(P:VCC) E39.14(P:VCC) E40.8(P:VCC) E41.8(P:VCC) E42.14(P:VCC) E43.14(P:VCC)

## Library data of the parts
C1-C48 = rcl:C-US: CAPACITOR, American symbol
C49-C52 = rcl:CPOL-US: POLARIZED CAPACITOR, American symbol
D1-D5 = diode:1N4148: DIODE high speed (Philips)
E1 E4 E14 E24 E38 = 74xx-us:74*240: Octal BUFFER and LINE DRIVER, 3-state
E2 E5 E6 E9 E10 E12 E13 E17 E18 E42 E43 = 74xx-us:74*74: Dual D type positive edge triggered FLIP FLOP, preset and clear
E3 E11 E16 = 74xx-us:74*10: Triple 3-input NAND gate
E7 E15 = 74xx-us:74*04: Hex INVERTER
E8 E23 E29 E31 E39 = 74xx-us:74*00: Quad 2-input NAND gate
E19-E21 E25-E27 E32-E34 E36 E37 E40 E41 = dec-con:DS75453: Quad 2-input OR gate, open collector output
E22 E35 = maxim:MXD1000: DELAY LINE; OC_FARNELL: unknown; OC_NEWARK: unknown
E28 E30 = maxim:MXD1000P: DELAY LINE; OC_FARNELL: unknown; OC_NEWARK: unknown
H01/H20 H02/H21 H03/H22 H04/H23 H05/H24 = con-lstb:MA17-2: PIN HEADER; OC_FARNELL: unknown; OC_NEWARK: unknown
JP1 JP3 = dec-con:JP2Q: JUMPER
JP2 JP4 = jumper:JP3Q: JUMPER
PAD12-PAD15 PAD27-PAD36 PAD42-PAD44 = wirepad:1,6/0,8: THROUGH-HOLE PAD
R11 R12 R15-R22 R25-R30 = rcl:R-US_: RESISTOR, American symbol
U$1 = dec-con:QUAD: Quad-Height DEC board
U$2 = dec-con:OUTLINE-*: Board outlines for DEC boards.

## Net classes
1 Power: width 0.635 mm